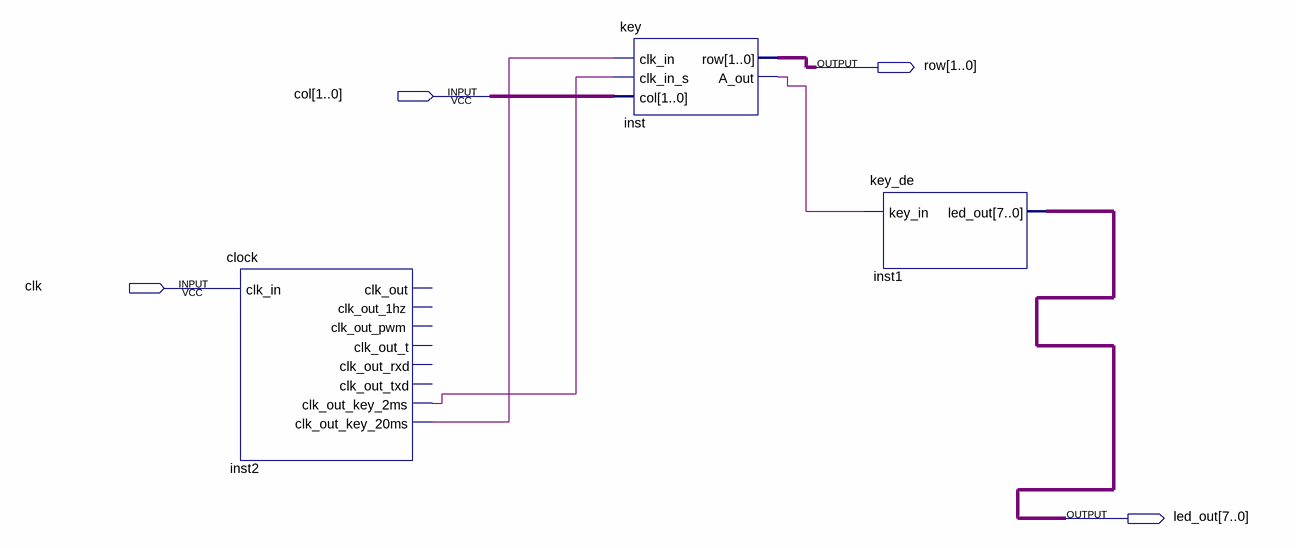
[diagram p0: schematic sheet]
// Quartus schematic key_bdf.bdf as structural Verilog: 3 symbols, 4 pins
module key_bdf (
  input  [1:0] col,
  input  clk,
  output [1:0] row,
  output [7:0] led_out
);

  wire inst2_clk_out_key_2ms, inst2_clk_out_key_20ms, inst_a_out;

  clock inst2 (
    .clk_in(clk), .clk_out_key_2ms(inst2_clk_out_key_2ms), .clk_out_key_20ms(inst2_clk_out_key_20ms));  // open: clk_out, clk_out_1hz, clk_out_pwm, clk_out_t, clk_out_rxd, clk_out_txd
  key inst (
    .clk_in(inst2_clk_out_key_20ms), .clk_in_s(inst2_clk_out_key_2ms), .col(col), .row(row),
    .A_out(inst_a_out));
  key_de inst1 (.key_in(inst_a_out), .led_out(led_out));
endmodule
